# Altium schematic sheet TEC_DRV.SchDoc
size 420 x 297 mm; Date: 3/24/2025; Address1: BEE - PC 1; Revision: V1.2.1; SheetNumber: 5; SheetTotal: 12
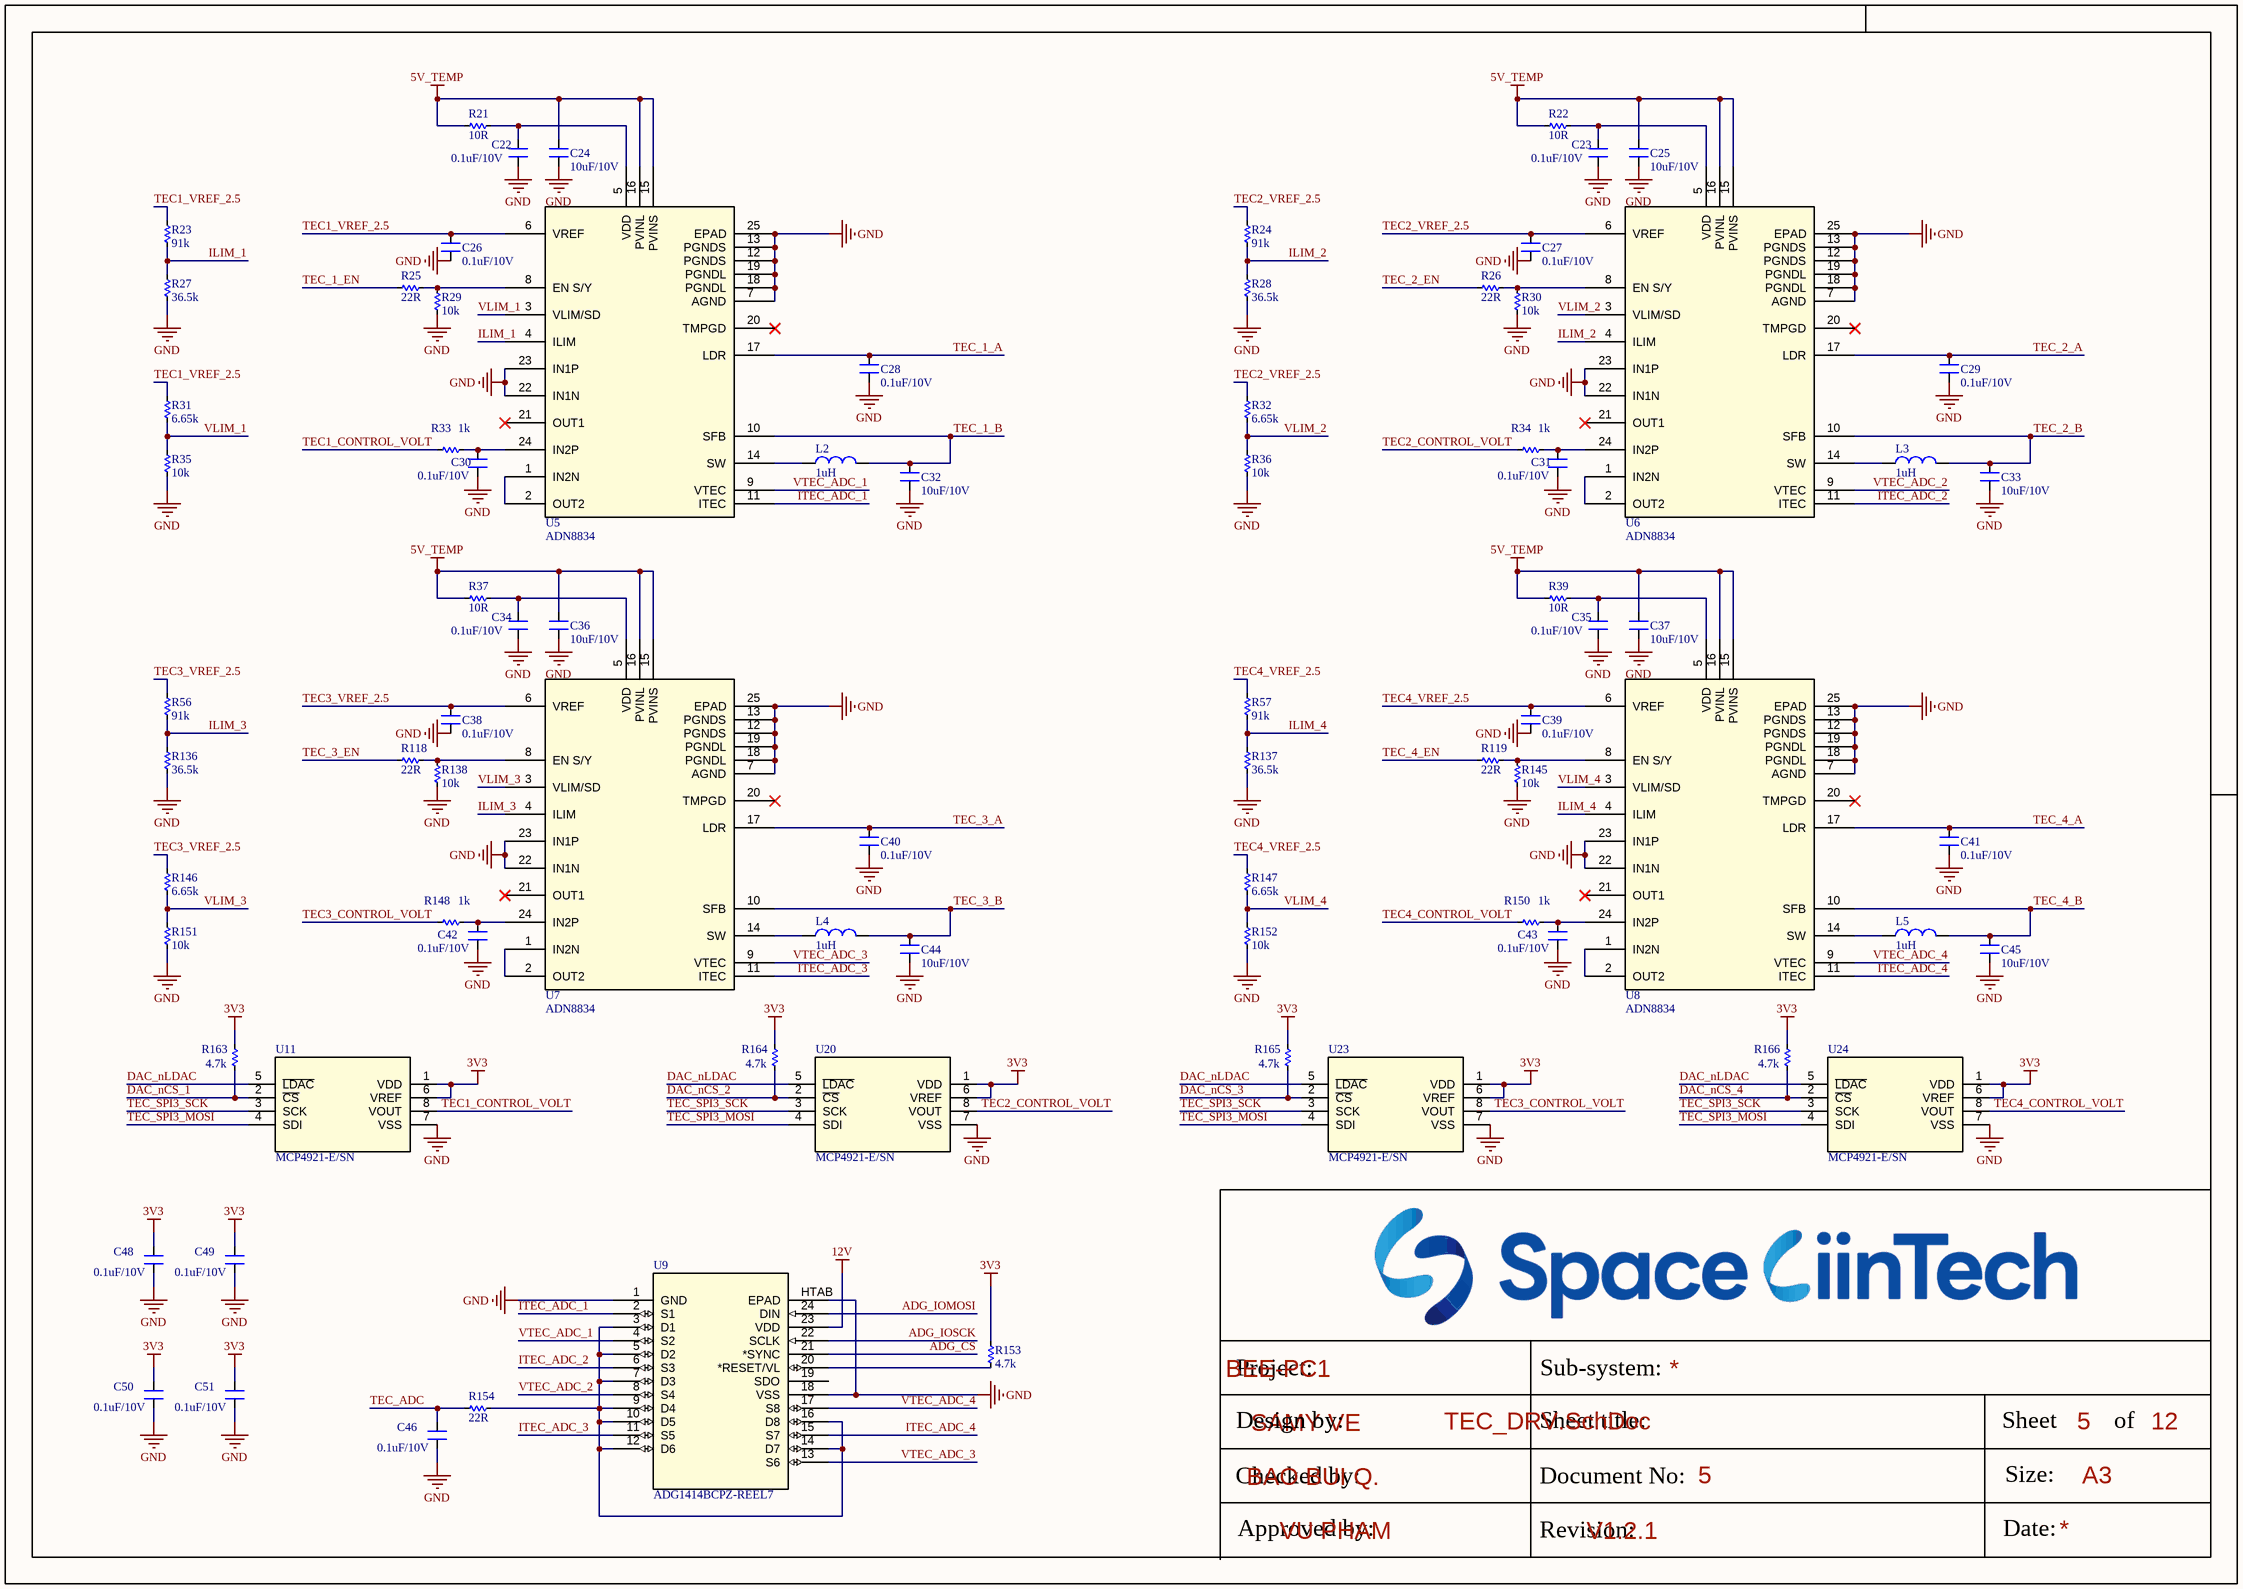
[diagram p0: TEC_DRV.SchDoc]

## Parts
C22  0.1uF/10V  [CAP_C_1608X80]
C23  0.1uF/10V  [CAP_C_1608X80]
C24  10uF/10V  [CAP_C_1608X80]
C25  10uF/10V  [CAP_C_1608X80]
C26  0.1uF/10V  [CAP_C_1608X80]
C27  0.1uF/10V  [CAP_C_1608X80]
C28  0.1uF/10V  [CAP_C_1608X80]
C29  0.1uF/10V  [CAP_C_1608X80]
C30  0.1uF/10V  [CAP_C_1608X80]
C31  0.1uF/10V  [CAP_C_1608X80]
C32  10uF/10V  [CAP_C_1608X80]
C33  10uF/10V  [CAP_C_1608X80]
C34  0.1uF/10V  [CAP_C_1608X80]
C35  0.1uF/10V  [CAP_C_1608X80]
C36  10uF/10V  [CAP_C_1608X80]
C37  10uF/10V  [CAP_C_1608X80]
C38  0.1uF/10V  [CAP_C_1608X80]
C39  0.1uF/10V  [CAP_C_1608X80]
C40  0.1uF/10V  [CAP_C_1608X80]
C41  0.1uF/10V  [CAP_C_1608X80]
C42  0.1uF/10V  [CAP_C_1608X80]
C43  0.1uF/10V  [CAP_C_1608X80]
C44  10uF/10V  [CAP_C_1608X80]
C45  10uF/10V  [CAP_C_1608X80]
C46  0.1uF/10V  [CAP_C_1608X80]
C48  0.1uF/10V  [CAP_C_1608X80]
C49  0.1uF/10V  [CAP_C_1608X80]
C50  0.1uF/10V  [CAP_C_1608X80]
C51  0.1uF/10V  [CAP_C_1608X80]
L2  1uH  [L-SMD-M-3.5x3.5x2mm]
L3  1uH  [L-SMD-M-3.5x3.5x2mm]
L4  1uH  [L-SMD-M-3.5x3.5x2mm]
L5  1uH  [L-SMD-M-3.5x3.5x2mm]
R21  10R  [RES_C_1608X60]
R22  10R  [RES_C_1608X60]
R23  91k  [RES_C_1608X60]
R24  91k  [RES_C_1608X60]
R25  22R  [RES_C_1608X60]
R26  22R  [RES_C_1608X60]
R27  36.5k  [RES_C_1608X60]
R28  36.5k  [RES_C_1608X60]
R29  10k  [RES_C_1608X60]
R30  10k  [RES_C_1608X60]
R31  6.65k  [RES_C_1608X60]
R32  6.65k  [RES_C_1608X60]
R33  1k  [RES_C_1608X60]
R34  1k  [RES_C_1608X60]
R35  10k  [RES_C_1608X60]
R36  10k  [RES_C_1608X60]
R37  10R  [RES_C_1608X60]
R39  10R  [RES_C_1608X60]
R56  91k  [RES_C_1608X60]
R57  91k  [RES_C_1608X60]
R118  22R  [RES_C_1608X60]
R119  22R  [RES_C_1608X60]
R136  36.5k  [RES_C_1608X60]
R137  36.5k  [RES_C_1608X60]
R138  10k  [RES_C_1608X60]
R145  10k  [RES_C_1608X60]
R146  6.65k  [RES_C_1608X60]
R147  6.65k  [RES_C_1608X60]
R148  1k  [RES_C_1608X60]
R150  1k  [RES_C_1608X60]
R151  10k  [RES_C_1608X60]
R152  10k  [RES_C_1608X60]
R153  4.7k  [RES_C_1608X60]
R154  22R  [RES_C_1608X60]
R163  4.7k  [RES_C_1608X60]
R164  4.7k  [RES_C_1608X60]
R165  4.7k  [RES_C_1608X60]
R166  4.7k  [RES_C_1608X60]
U5  ADN8834  [ADN8834]
U6  ADN8834  [ADN8834]
U7  ADN8834  [ADN8834]
U8  ADN8834  [ADN8834]
U9  ADG1414BCPZ-REEL7  [ADG1414BCPZ-REEL7]
U11  MCP4921-E/SN  [SO8]
U20  MCP4921-E/SN  [SO8]
U23  MCP4921-E/SN  [SO8]
U24  MCP4921-E/SN  [SO8]

## Nets
3V3: C48.2 C49.2 C50.2 C51.2 R153.2 R163.1 R164.1 R165.1 R166.1 U11.1(VDD) U11.6(VREF) U20.1(VDD) U20.6(VREF) U23.1(VDD) U23.6(VREF) U24.1(VDD) U24.6(VREF)
5V_TEMP: C24.2 C25.2 C36.2 C37.2 R21.1 R22.1 R37.1 R39.1 U5.15(PVINS) U5.16(PVINL) U6.15(PVINS) U6.16(PVINL) U7.15(PVINS) U7.16(PVINL) U8.15(PVINS) U8.16(PVINL)
12V: U9.23(VDD)
GND: C22.1 C23.1 C24.1 C25.1 C26.1 C27.1 C28.1 C29.1 C30.1 C31.1 C32.1 C33.1 C34.1 C35.1 C36.1 C37.1 C38.1 C39.1 C40.1 C41.1 C42.1 C43.1 C44.1 C45.1 C46.1 C48.1 C49.1 C50.1 C51.1 R27.2 R28.2 R29.2 R30.2 R35.2 R36.2 R136.2 R137.2 R138.2 R145.2 R151.2 R152.2 U5.7(AGND) U5.12(PGNDS) U5.13(PGNDS) U5.18(PGNDL) U5.19(PGNDL) U5.22(IN1N) U5.23(IN1P) U5.25(EPAD) U6.7(AGND) U6.12(PGNDS) U6.13(PGNDS) U6.18(PGNDL) U6.19(PGNDL) U6.22(IN1N) U6.23(IN1P) U6.25(EPAD) U7.7(AGND) U7.12(PGNDS) U7.13(PGNDS) U7.18(PGNDL) U7.19(PGNDL) U7.22(IN1N) U7.23(IN1P) U7.25(EPAD) U8.7(AGND) U8.12(PGNDS) U8.13(PGNDS) U8.18(PGNDL) U8.19(PGNDL) U8.22(IN1N) U8.23(IN1P) U8.25(EPAD) U9.1(GND) U9.18(VSS) U9.HTAB(EPAD) U11.7(VSS) U20.7(VSS) U23.7(VSS) U24.7(VSS)
ADG_CS: U9.21(*SYNC)
ADG_IOMOSI: U9.24(DIN)
ADG_IOSCK: U9.22(SCLK)
DAC_nCS_1: R163.2 U11.2(~{CS})
DAC_nCS_2: R164.2 U20.2(~{CS})
DAC_nCS_3: R165.2 U23.2(~{CS})
DAC_nCS_4: R166.2 U24.2(~{CS})
DAC_nLDAC: U11.5(~{LDAC}) U20.5(~{LDAC}) U23.5(~{LDAC}) U24.5(~{LDAC})
ILIM_1: R23.2 R27.1 U5.4(ILIM)
ILIM_2: R24.2 R28.1 U6.4(ILIM)
ILIM_3: R56.2 R136.1 U7.4(ILIM)
ILIM_4: R57.2 R137.1 U8.4(ILIM)
ITEC_ADC_1: U5.11(ITEC) U9.2(S1)
ITEC_ADC_2: U6.11(ITEC) U9.6(S3)
ITEC_ADC_3: U7.11(ITEC) U9.11(S5)
ITEC_ADC_4: U8.11(ITEC) U9.15(S7)
TEC1_CONTROL_VOLT: R33.1 U11.8(VOUT)
TEC1_VREF_2.5: C26.2 R23.1 R31.1 U5.6(VREF)
TEC2_CONTROL_VOLT: R34.1 U20.8(VOUT)
TEC2_VREF_2.5: C27.2 R24.1 R32.1 U6.6(VREF)
TEC3_CONTROL_VOLT: R148.1 U23.8(VOUT)
TEC3_VREF_2.5: C38.2 R56.1 R146.1 U7.6(VREF)
TEC4_CONTROL_VOLT: R150.1 U24.8(VOUT)
TEC4_VREF_2.5: C39.2 R57.1 R147.1 U8.6(VREF)
TEC_1_A: C28.2 U5.17(LDR)
TEC_1_B: C32.2 L2.2 U5.10(SFB)
TEC_1_EN: R25.1
TEC_2_A: C29.2 U6.17(LDR)
TEC_2_B: C33.2 L3.2 U6.10(SFB)
TEC_2_EN: R26.1
TEC_3_A: C40.2 U7.17(LDR)
TEC_3_B: C44.2 L4.2 U7.10(SFB)
TEC_3_EN: R118.1
TEC_4_A: C41.2 U8.17(LDR)
TEC_4_B: C45.2 L5.2 U8.10(SFB)
TEC_4_EN: R119.1
TEC_ADC: C46.2 R154.1
TEC_SPI3_MOSI: U11.4(SDI) U20.4(SDI) U23.4(SDI) U24.4(SDI)
TEC_SPI3_SCK: U11.3(SCK) U20.3(SCK) U23.3(SCK) U24.3(SCK)
VLIM_1: R31.2 R35.1 U5.3(VLIM/SD)
VLIM_2: R32.2 R36.1 U6.3(VLIM/SD)
VLIM_3: R146.2 R151.1 U7.3(VLIM/SD)
VLIM_4: R147.2 R152.1 U8.3(VLIM/SD)
VTEC_ADC_1: U5.9(VTEC) U9.4(S2)
VTEC_ADC_2: U6.9(VTEC) U9.8(S4)
VTEC_ADC_3: U7.9(VTEC) U9.13(S6)
VTEC_ADC_4: U8.9(VTEC) U9.17(S8)
NetC22_2: C22.2 R21.2 U5.5(VDD)
NetC23_2: C23.2 R22.2 U6.5(VDD)
NetC30_2: C30.2 R33.2 U5.24(IN2P)
NetC31_2: C31.2 R34.2 U6.24(IN2P)
NetC34_2: C34.2 R37.2 U7.5(VDD)
NetC35_2: C35.2 R39.2 U8.5(VDD)
NetC42_2: C42.2 R148.2 U7.24(IN2P)
NetC43_2: C43.2 R150.2 U8.24(IN2P)
NetL2_1: L2.1 U5.14(SW)
NetL3_1: L3.1 U6.14(SW)
NetL4_1: L4.1 U7.14(SW)
NetL5_1: L5.1 U8.14(SW)
NetR25_2: R25.2 R29.1 U5.8(EN_S/Y)
NetR26_2: R26.2 R30.1 U6.8(EN_S/Y)
NetR118_2: R118.2 R138.1 U7.8(EN_S/Y)
NetR119_2: R119.2 R145.1 U8.8(EN_S/Y)
NetR153_1: R153.1 U9.20(*RESET/VL)
NetR154_2: R154.2 U9.3(D1) U9.5(D2) U9.7(D3) U9.9(D4) U9.10(D5) U9.12(D6) U9.14(D7) U9.16(D8)
NetU5_1: U5.1(IN2N) U5.2(OUT2)
NetU6_1: U6.1(IN2N) U6.2(OUT2)
NetU7_1: U7.1(IN2N) U7.2(OUT2)
NetU8_1: U8.1(IN2N) U8.2(OUT2)

Not connected (* = marked no-connect by the designer): U5 20(TMPGD)* 21(OUT1)*; U6 20(TMPGD)* 21(OUT1)*; U7 20(TMPGD)* 21(OUT1)*; U8 20(TMPGD)* 21(OUT1)*; U9 19(SDO)

## Notes on the sheet
- Project:
- BEE-PC1
- Sub-system:
- Design by:
- SAMY VE
- BAO BUI Q.
- Sheet title:
- Sheet
- A3
- of
- Checked by:
- Approved by:
- VU PHAM
- Revision:
- Document No:
- Size:
- Date:

## Library data of the parts
C22-C46 C48-C51 = Capacitors: Value: 33pF
L2-L5 = L-SMD-1: partNo: 78477010; Manufacturer: Wurth Elektronik; Inductance: 1.0 μH; ComponentLink1Description: Manufacturer; ComponentLink1URL: http://www.we-online.de; Created by: Baojun Chen; Created Date: Nov.2015; ComponentLink2Description: Datasheet; ComponentLink2URL: http://katalog.we-online.de/pbs/datasheet/78477010.pdf
R21-R37 R39 R56 R57 R118 R119 R136-R138 R145-R148 R150-R154 R163-R166 = Res SMD: SMD; Manufacturer: Generic Components; Class: Passive; Published: 08/06/2000; Publisher: Altium Hobart Technology Centre
U5-U8 = ADN8834: IC THERMO COOLER DRIVER 24LFCSP; Mfr_Name: Analog Devices Inc; RefDes: RefDes; Type: Type
U9 = ADG1414: IC SW SPST-NOX8 11.5OHM 24LFCSP
U11 U20 U23 U24 = MCP4921-E/SN: 12 Bit Digital to Analog Converter, P/N: MCP4921-E/SN